# EAGLE design azo_overdrive (EAGLE 7.5.0)
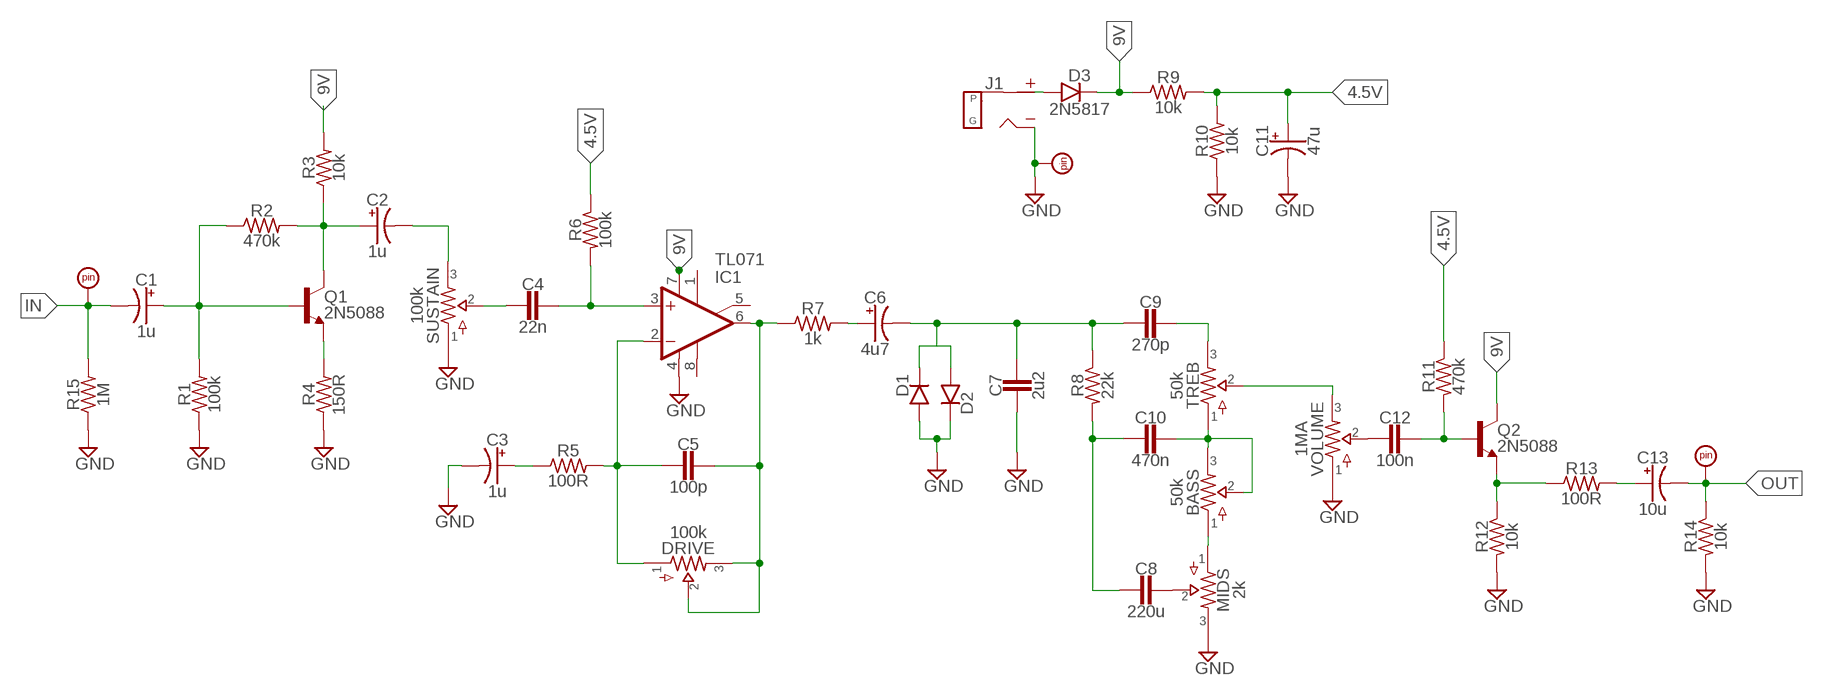
[diagram p0: schematic, sheet 1]

## Parts
BASS  50k  POTS16MM  [16MM]
C1  1u  0501  [050_020_1]
C2  1u  0501  [050_020_1]
C3  1u  0501  [050_020_1]
C4  22n  CER/FILM2  [050X030_025_2]
C5  100p  CER/FILM2  [050X030_025_2]
C6  4u7  0501  [050_020_1]
C7  2u2  CER/FILM2  [050X030_025_2]
C8  220u  CER/FILM2  [050X030_025_2]
C9  270p  CER/FILM2  [050X030_025_2]
C10  470n  CER/FILM2  [050X030_025_2]
C11  47u  0501  [050_020_1]
C12  100n  CER/FILM2  [050X030_025_2]
C13  10u  0501  [050_020_1]
D1  DO35.2  [DO35-2]
D2  DO35.2  [DO35-2]
D3  2N5817  DO41.3  [DO41-3]
DRIVE  100k  POTS16MM  [16MM]
GND  PADSQR  [SQUARE]
IC1  TL071  SINGLETH  [DIL08]
IN  PADSQR  [SQUARE]
J1  DC_MONO  [DC]
MIDS  2k  POTS16MM  [16MM]
OUT  PADSQR  [SQUARE]
Q1  2N5088  [TO92-]
Q2  2N5088  [TO92-]
R1  100k  R_.3B  [R0207/3]
R2  470k  R_.3B  [R0207/3]
R3  10k  R_.3B  [R0207/3]
R4  150R  R_.3B  [R0207/3]
R5  100R  R_.3B  [R0207/3]
R6  100k  R_.3B  [R0207/3]
R7  1k  R_.3B  [R0207/3]
R8  22k  R_.3B  [R0207/3]
R9  10k  R_.3B  [R0207/3]
R10  10k  R_.3B  [R0207/3]
R11  470k  R_.3B  [R0207/3]
R12  10k  R_.3B  [R0207/3]
R13  100R  R_.3B  [R0207/3]
R14  10k  R_.3B  [R0207/3]
R15  1M  R_.3B  [R0207/3]
SUSTAIN  100k  POTSTRIM  [2262_TRIM]
TREB  50k  POTS16MM  [16MM]
VOLUME  1MA  POTS16MM  [16MM]

## Nets
4.5V: C11.+ R6.1 R9.2 R10.2 R11.1
9V: D3.C IC1.7(V+) Q2.1(C) R3.2 R9.1
GND: C3.- C7.2 C11.- D1.A D2.C GND.1 IC1.4(V-) J1.S(SLEEVE) MIDS.3 R1.1 R4.1 R10.1 R12.2 R14.2 R15.1 SUSTAIN.1 VOLUME.1
IN: C1.- IN.1 R15.2
N$1: C1.+ Q1.2(B) R1.2 R2.1
N$2: C4.1 IC1.3(+IN) R6.2
N$3: C2.+ Q1.1(C) R2.2 R3.1
N$4: Q1.3(E) R4.2
N$5: C2.- SUSTAIN.3
N$6: D3.A J1.T(TIP)
N$7: C5.2 DRIVE.1 IC1.2(-IN) R5.2
N$8: C3.+ R5.1
N$9: C4.2 SUSTAIN.2
N$10: C6.- C7.1 C9.2 D1.C D2.A R8.1
N$12: C5.1 DRIVE.2 DRIVE.3 IC1.6(OUT) R7.1
N$13: C8.1 MIDS.2
N$14: C6.+ R7.2
N$15: C9.1 TREB.3
N$16: C8.2 C10.2 R8.2
N$17: BASS.2 BASS.3 C10.1 TREB.1
N$18: BASS.1 MIDS.1
N$19: C12.1 Q2.2(B) R11.2
N$20: TREB.2 VOLUME.3
N$21: C12.2 VOLUME.2
N$22: Q2.3(E) R12.1 R13.1
N$23: C13.+ R13.2
OUT: C13.- OUT.1 R14.1
Unconnected: IC1.1(ON1) IC1.5(ON2) IC1.8(OPT)

## Library data of the parts
BASS DRIVE MIDS SUSTAIN TREB VOLUME = potentiometers:POTS
C1-C3 C6 C11 C13 = capacitors-elec:050: 0.22 - 100uF Xicon values at Mouser.com: 10V: 10 - 100uF; 16V: 2.2 - 47uF; 25V: 0.47 - 47uF; 50V: 0.22 - 22uF
C4 C5 C7-C10 C12 = capacitors-film:CER/FILM: 47 - 120pF Xicon Ceramic Disc 2.5mm lead spacing
D1 D2 = diodes:DO35: DO-35 Package Diodes: 1N914
D3 = diodes:DO41: DO-41 Package Diodes: 1N4001 - 1N40019 Zener Diodes: 1N4728 - 1N4764
GND IN OUT = supply pins:PAD
IC1 = integrated circuits:SINGLE: OP AMP
J1 = jacks:DC_MONO
Q1 Q2 = transistors:2N5088: NPN Transistor
R1-R15 = resistors:R_

## Board
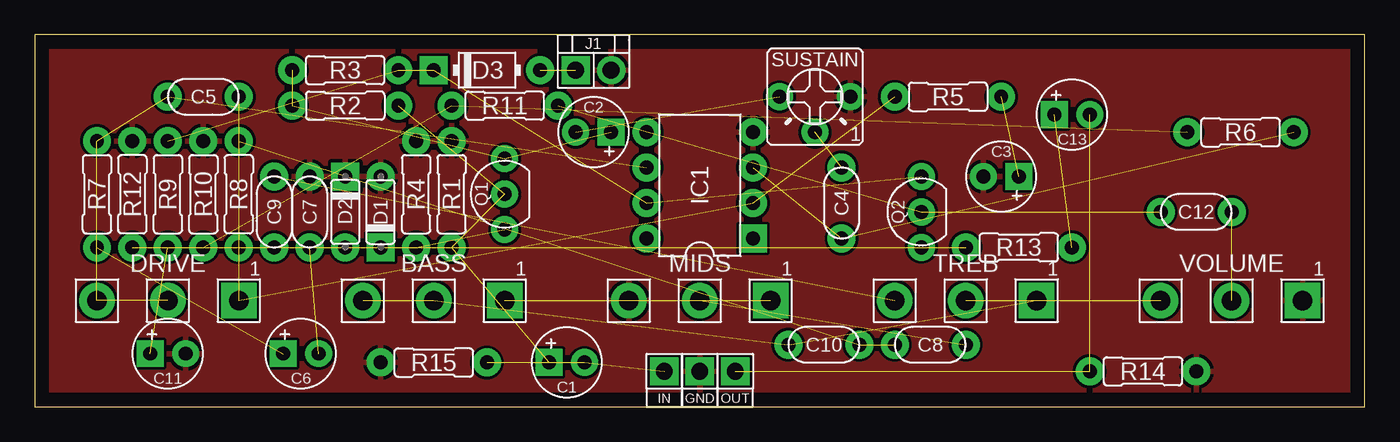
[diagram p1: board, top side]
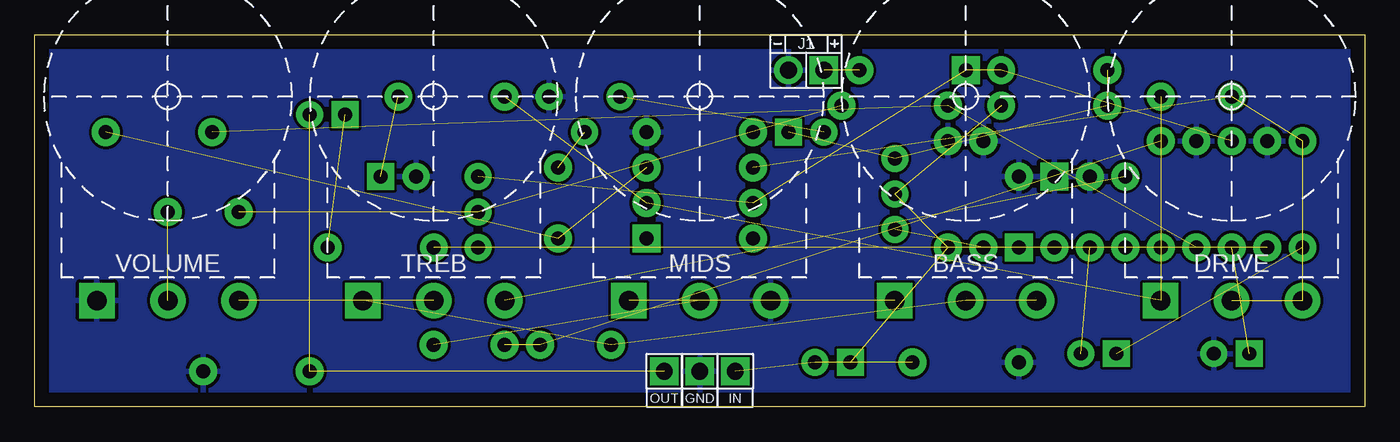
[diagram p2: board, bottom side, seen from below]

Size 95.25 x 26.66 mm. Coordinates in mm from the lower left corner, seen from the top.
Outline: 0,0 95.25,0 95.25,26.66 0,26.66 0,0
Copper layers (1*16): Top 0.035mm / dielectric 1.5mm / Bottom 0.035mm
Design rules "default": minimum track width 10mil, minimum drill 24mil, track to track 8mil, track to pad 8mil, pad to pad 8mil, via to via 8mil, smd to smd 8mil, copper to edge 40mil, drill to drill 8mil, minimum pad ring 10mil, minimum via ring 8mil, stop-mask expansion 4mil, vias tented up to drill 0mil, thermal gap 10mil

### Footprints (pad centres in the part's own frame; a part is rotated, then mirrored left to right if it is on the bottom)
16MM = drill 1.4 pad 2.54 square: 1 5.08,0 | drill 1.4 pad 2.54: 2 0,0; 3 -5.08,0
050_020_1 = drill 1 pad 1.93 square: + -1.27,0 | drill 1 pad 1.93: - 1.27,0
050X030_025_2 = drill 1 pad 2: 1 -2.54,0; 2 2.54,0
DO35-2 = drill 1 pad 2: A 2.54,0 | drill 1 pad 2 square: C -2.54,0
DO41-3 = drill 1 pad 2: A 3.81,0 | drill 1 pad 2 square: C -3.81,0
SQUARE = drill 1.2 pad 2.032 square: 1 0,0
DIL08 = drill 1 pad 2 square: 1 -3.81,-3.81 | drill 1 pad 2: 2 -1.27,-3.81; 3 1.27,-3.81; 4 3.81,-3.81; 5 3.81,3.81; 6 1.27,3.81; 7 -1.27,3.81; 8 -3.81,3.81
DC = drill 1.2 pad 2.032: S -1.27,0 | drill 1.2 pad 2.032 square: T 1.27,0
TO92- = drill 1 pad 1.93: 1 2.54,0; 2 0,0; 3 -2.54,0
R0207/3 = drill 1 pad 2: 1 -3.81,0; 2 3.81,0
2262_TRIM = drill 1 pad 1.93: 1 -2.54,0; 2 0,2.54; 3 2.54,0

### Placement (x,y rotation side)
BASS  28.57,7.62 0 top
C1  38.1,3.17 0 top
C2  40.01,19.68 180 top
C3  69.22,16.51 180 top
C4  57.78,14.61 90 top
C5  12.06,22.23 0 top
C6  19.05,3.81 0 top
C7  19.68,13.97 90 top
C8  64.14,4.45 180 top
C9  17.14,13.97 270 top
C10  56.52,4.45 0 top
C11  9.53,3.81 0 top
C12  83.19,13.97 0 top
C13  74.3,20.95 0 top
D1  24.77,13.97 90 top
D2  22.23,13.97 270 top
D3  32.38,24.13 0 top
DRIVE  9.53,7.62 0 top
GND  47.62,2.54 0 top
IC1  47.62,15.88 90 top
IN  45.09,2.54 0 top
J1  40.01,24.13 0 bottom
MIDS  47.62,7.62 0 top
OUT  50.16,2.54 0 top
Q1  33.66,15.24 90 top
Q2  63.5,13.97 90 top
R1  29.84,15.24 270 top
R2  22.23,21.59 180 top
R3  22.23,24.13 0 top
R4  27.3,15.24 270 top
R5  65.41,22.23 180 top
R6  86.36,19.68 0 top
R7  4.45,15.24 270 top
R8  14.61,15.24 90 top
R9  9.53,15.24 270 top
R10  12.06,15.24 270 top
R11  33.66,21.59 0 top
R12  6.99,15.24 90 top
R13  70.48,11.43 0 top
R14  79.38,2.54 0 top
R15  28.57,3.17 0 top
SUSTAIN  55.88,22.23 180 top
TREB  66.67,7.62 0 top
VOLUME  85.72,7.62 0 top

### Tracks (layer width: path | path; a pad name or v marks a point on that pad's centre or on a via)
4.5V  (4 unrouted)
9V  (4 unrouted)
GND
  pour Top: 0,26.67 95.25,26.67 95.25,0 0,0
  pour Bottom: 0,26.67 95.89,26.04 95.25,0 0,0
IN  (2 unrouted)
N$1  (3 unrouted)
N$2  (2 unrouted)
N$3  (3 unrouted)
N$4  (1 unrouted)
N$5  (1 unrouted)
N$6  (1 unrouted)
N$7  (3 unrouted)
N$8  (1 unrouted)
N$9  (1 unrouted)
N$10  (5 unrouted)
N$12  (4 unrouted)
N$13  (1 unrouted)
N$14  (1 unrouted)
N$15  (1 unrouted)
N$16  (2 unrouted)
N$17  (3 unrouted)
N$18  (1 unrouted)
N$19  (2 unrouted)
N$20  (1 unrouted)
N$21  (1 unrouted)
N$22  (2 unrouted)
N$23  (1 unrouted)
OUT  (2 unrouted)